# Altium schematic sheet Power Source.SchDoc: Power Architechture Block Diagram
size 292 x 193 mm; DocumentNumber: 2; SheetNumber: 2; SheetTotal: 44
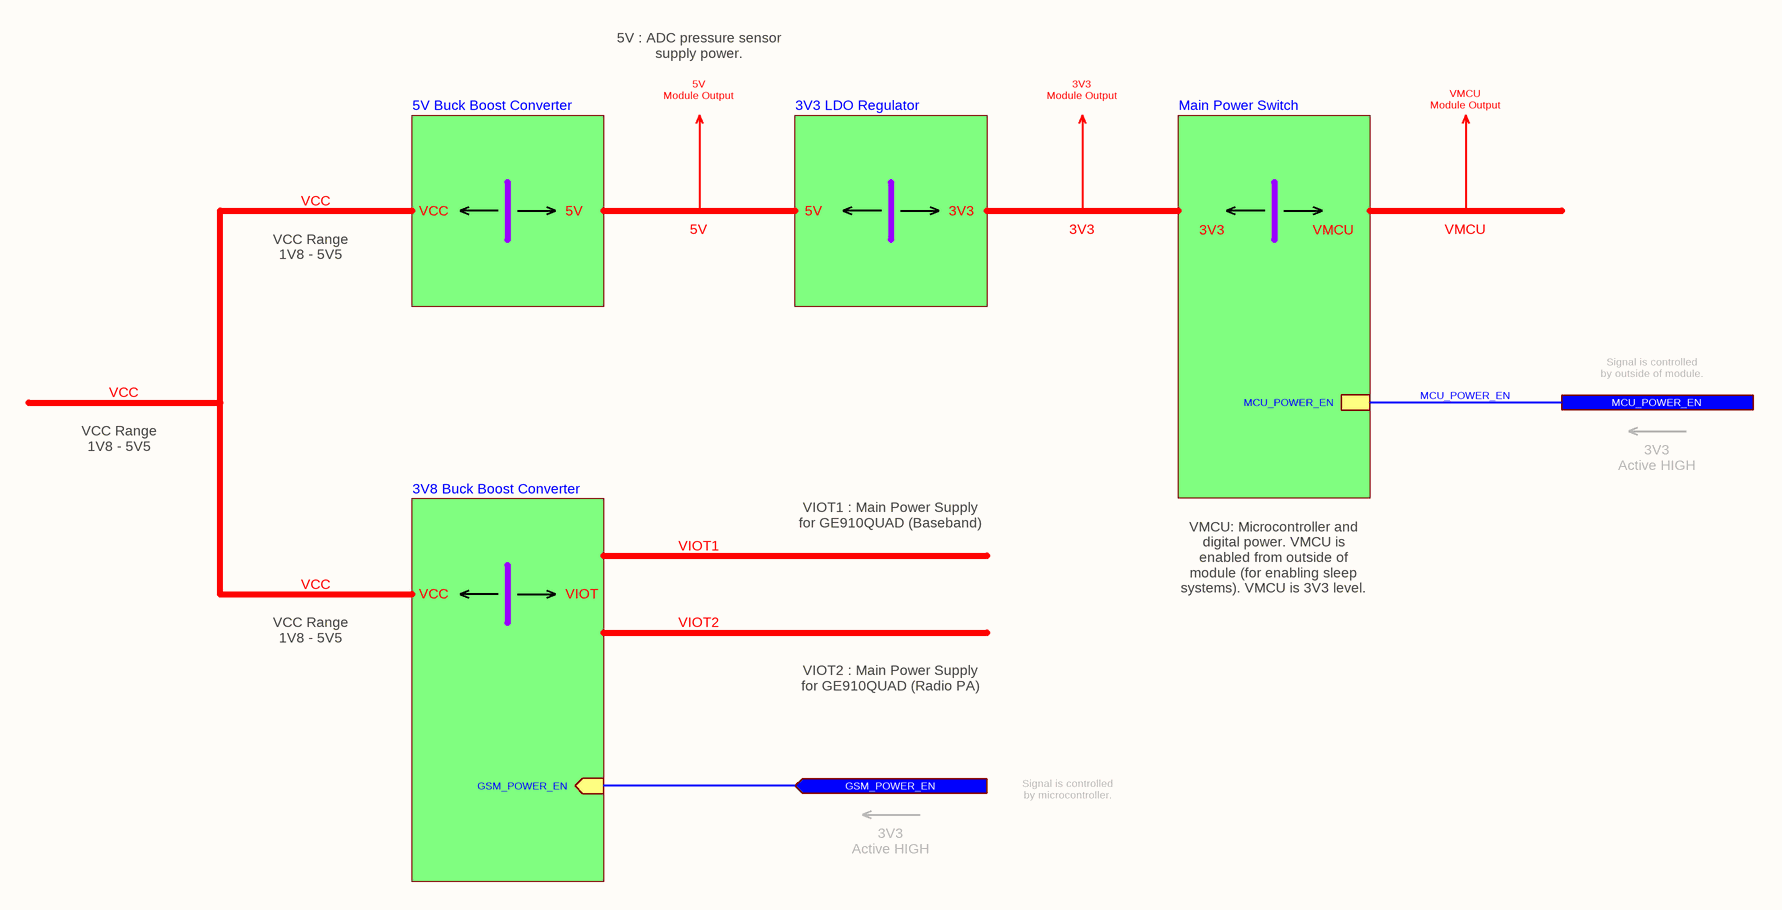
[diagram p0: Power Source.SchDoc]

## Sub-sheets
3V3 LDO Regulator = 3V3 LDO Regulator.SchDoc: no entries
3V8 Buck Boost Converter = 3V8 Buck Boost Converter.SchDoc: GSM_POWER_EN (in)
5V Buck Boost Converter = 5V Buck Boost Converter.SchDoc: no entries
Main Power Switch = Main Power Switch.SchDoc: MCU_POWER_EN

## Ports
GSM_POWER_EN (in), MCU_POWER_EN

## Nets
GSM_POWER_EN: port GSM_POWER_EN, sheet 3V8 Buck Boost Converter/GSM_POWER_EN
MCU_POWER_EN: port MCU_POWER_EN, sheet Main Power Switch/MCU_POWER_EN

## Notes on the sheet
- 5V : ADC pressure sensor supply power.
- 5V
  Module Output
- 3V3
  Module Output
- VMCU
  Module Output
- VCC
- 5V
- 3V3
- VMCU
- VCC Range
  1V8 - 5V5
- Signal is controlled by outside of module.
- 3V3
  Active HIGH
- VIOT
- VIOT2
- VIOT1
- VIOT1 : Main Power Supply for GE910QUAD (Baseband)
- VMCU: Microcontroller and digital power. VMCU is enabled from outside of module (for enabling sleep systems). VMCU is 3V3 level.
- VIOT2 : Main Power Supply for GE910QUAD (Radio PA)
- Signal is controlled by microcontroller.
- © 2021 All rights reserved.
  This document may not, in whole or in part, be copied, photocopied, reproduced, translated or converted to any electronic or machine readable from without prior written permission of Mehmet Günce Akkoyun.
  Engineer contact : akkoyun@me.com
- Property of
- Engineer :
- Date :
- Size :
- A4
- Time :
- Project :
- Page :
- /
- Customer :
- Product ID :
- Module ID :
- Version :
- File :
- Revision :